# Altium project IMX6 DEV BOARD.PrjPcb (part 4 of 4)

## Sheet uart_console.SchDoc
size A4; SheetNumber: 16; SheetTotal: 21
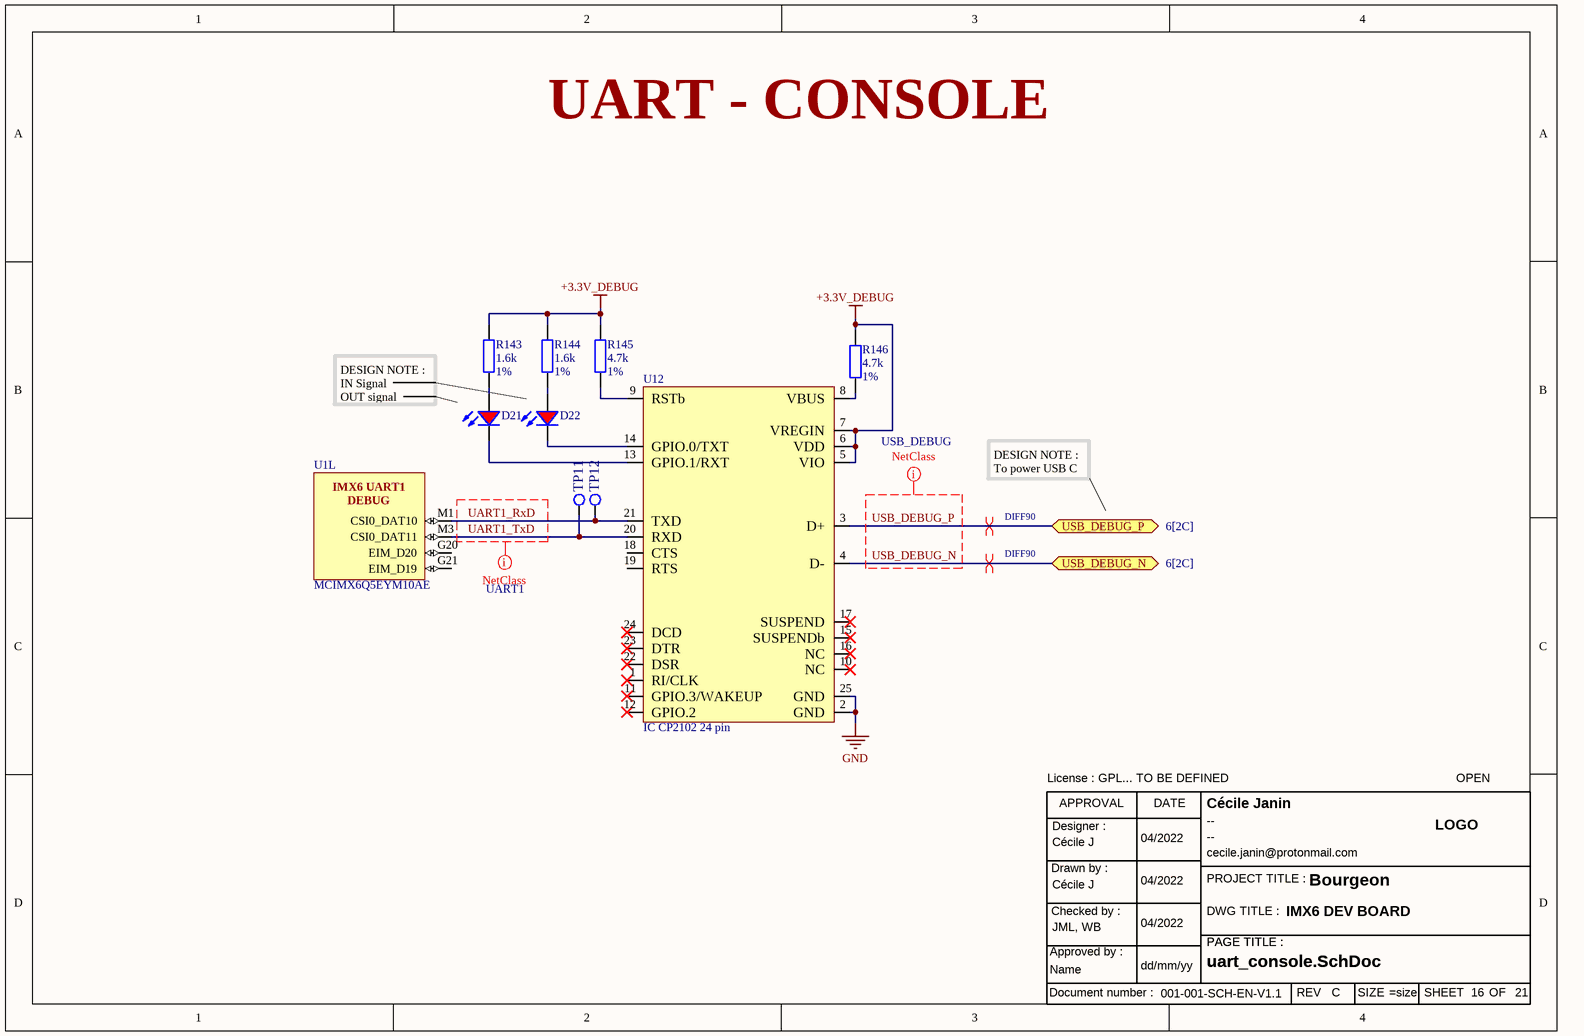
[diagram p18: uart_console.SchDoc]

### Parts
D21  Red, 2V, 120deg  [LED red 0603]  (value not drawn)
D22  Red, 2V, 120deg  [LED red 0603]  (value not drawn)
R143  1.6k  pourcentage: 1%  [Res 0402/1005]
R144  1.6k  pourcentage: 1%  [Res 0402/1005]
R145  4.7k  pourcentage: 1%  [Res 0402/1005]
R146  4.7k  pourcentage: 1%  [Res 0402/1005]
TB15  Title bloc ANSI modified  (value not drawn)
TP11  Test Point  [testpoint 1mm]  (value not drawn)
TP12  Test Point  [testpoint 1mm]  (value not drawn)
U1  MCIMX6Q5EYM10AE  [FRES-2197-01]  (part L of 21)
U12  IC CP2102 24 pin  [QFN24]

### Ports
USB_DEBUG_N (bidir, see 6[2C]), USB_DEBUG_P (bidir, see 6[2C])

### Nets
+3.3V_DEBUG: R143.2 R144.2 R145.2 R146.2 U12.5(VIO) U12.6(VDD) U12.7(VREGIN)
GND: U12.2(GND) U12.25(GND)
UART1_RxD: TP12.1(tp) U1.M1(CSI0_DAT10) U12.21(TXD)
UART1_TxD: TP11.1(tp) U1.M3(CSI0_DAT11) U12.20(RXD)
USB_DEBUG_N: U12.4(D-) ; port USB_DEBUG_N
USB_DEBUG_P: U12.3(D+) ; port USB_DEBUG_P
NetD21_1: D21.1(K) U12.13(GPIO.1/RXT)
NetD21_2: D21.2(A) R143.1
NetD22_1: D22.1(K) U12.14(GPIO.0/TXT)
NetD22_2: D22.2(A) R144.1
NetR145_1: R145.1 U12.9(RSTb)
NetR146_1: R146.1 U12.8(VBUS)

Not connected (* = marked no-connect by the designer): U1 G20(EIM_D20) G21(EIM_D19); U12 1(RI/CLK)* 10(NC)* 11(GPIO.3/WAKEUP)* 12(GPIO.2)* 15(SUSPENDb)* 16(NC)* 17(SUSPEND)* 18(CTS) 19(RTS) 22(DSR)* 23(DTR)* 24(DCD)*

### Layout directives
net class UART1: UART1_RxD, UART1_TxD
net class USB_DEBUG: USB_DEBUG_N, USB_DEBUG_P
differential pair; differential pair class DIFF90: USB_DEBUG_N, USB_DEBUG_P

### Notes on the sheet
- UART - CONSOLE
- DESIGN NOTE :
  IN Signal
  OUT signal
- DESIGN NOTE :
  To power USB C
- (in symbol IMX6Q5EYM10AE, part L) IMX6 UART1 / DEBUG
- (in symbol Title bloc ANSI) APPROVAL; DATE; Designer :; LOGO; Drawn by :; PROJECT TITLE :; Checked by :; DWG TITLE :; PAGE TITLE :; Approved by :; Document number :; REV; SIZE; SHEET; OF

### Library data of the parts
D21 D22 = LED Red 0603: WL-SMCC SMD Mono-color Chip LED Compact, size 0603, Red, 2V, 120deg 150060RS73220; Dominant Wavelength: 624nm; Luminous Intensity: 90mcd; Peak Wavelength: 632nm; Chip Technology: AlInGaP; ComponentLink1URL: http://www.we-online.de; ComponentLink2Description: Datasheet; ComponentLink2URL: https://katalog.we-online.com/led/datasheet/150060RS73220.pdf; Part Number: 150060RS73220; Published Date: July 2019; Publisher: Wurth Elektronik; Size: 0603; Viewing Angle: 120deg; Packaging: Tape and Reel; Emitting Color: Red; Mounting Technology: SMT; Forward Voltage: 2V; Operating Temperature: -40 to +85degC
R143 R144 = res 1.6k 1%: res 1.6k 1% 0402
R145 R146 = res 4.7k 1%: res 4.7k 1% 0402
TB15 = Title bloc ANSI
TP11 TP12 = Test Point: Test point 1mm diameter
U1 = IMX6Q5EYM10AE: 32-Bit i.MX 6 Quad Application Processor, 1 GHz, 256 KB RAM, Extended Consumer Grade, 624-Pin FCPBGA, RoHS, Tape and Reel; PartNumber: MCIMX6Q5EYM10ACR; Manufacturer: Freescale Semiconductor; CAN: FlexCAN; Number of Cores: 4 Spec; External Memory Supported: DDR3, DDR3L, FLASH, LPDDR2; Speed Grade: 1 GHz; Core Type: ARM Cortex A9; Cache (KB): 32; Ethernet: 1 Gbps + IEEE 1588; Internal RAM (KB): 256; ComponentLink1Description: Manufacturer URL; ComponentLink2Description: Datasheet; DatasheetVersion: Rev. 2.3; ComponentLink3URL: http://cache.freescale.com/files/32bit/doc/data_sheet/IMX6DQCEC.pdf?fpsp=1&WT_TYPE=Data%20Sheets&WT_VENDOR=FREESCALE&WT_FILE_FORMAT=pdf&WT_ASSET=Documentation; ComponentLink1URL: http://www.freescale.com/; Packing: Tape and Reel; Temperature Range: -20 to 105 degC; ComponentLink2URL: http://cache.freescale.com/files/32bit/doc/data_sheet/IMX6DQCEC.pdf?fpsp=1&WT_TYPE=Data%20Sheets&WT_VENDOR=FREESCALE&WT_FILE_FORMAT=pdf&WT_ASSET=Documentation; ComponentLink3Description: Package Specification; PackageVersion: Rev. A; RoHS: TRUE; Quad/Dual CPU: i.MX 6Quad; Mounting Technology: Surface Mount; PackageReference: FCPBGA-624; PackageDescription: 624-pin Ball Grid Array Package, Body 21 x 21mm, Pitch 0.8mm
U12 = IC CP2102 24 pin: UART to USB converter

## Sheet usb_host_otg.SchDoc
size A3; SheetNumber: 17; SheetTotal: 21
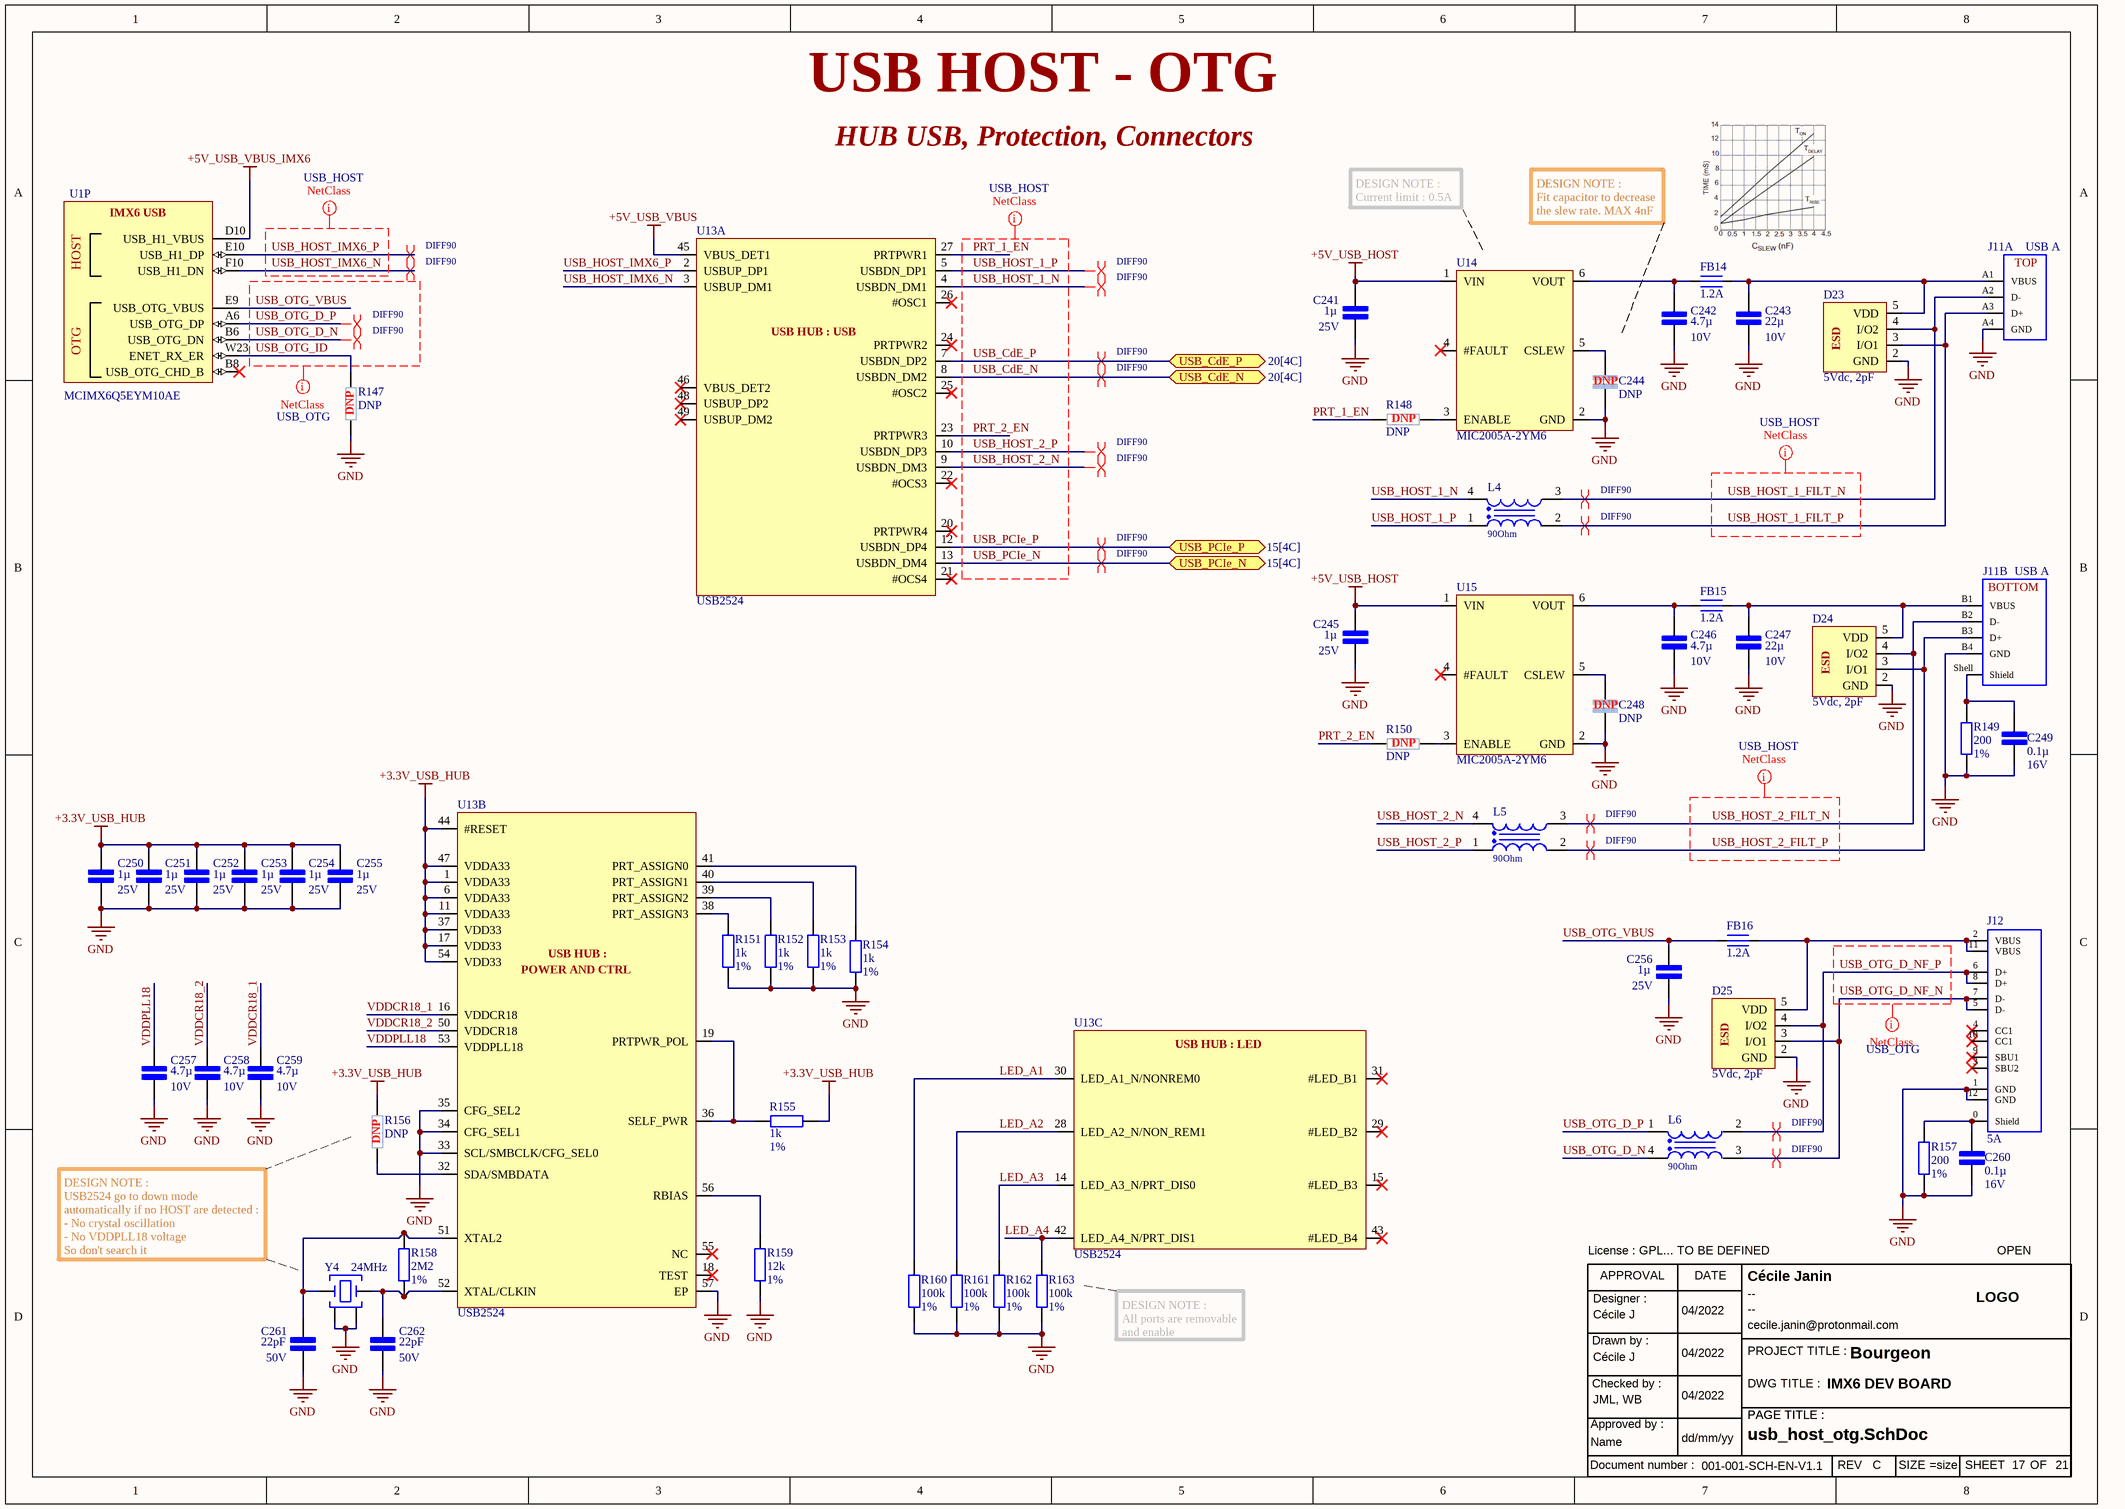
[diagram p19: usb_host_otg.SchDoc]

### Parts
C241  1µ  Tension du diélectrique: 25V  [Cap cer 0402/1005]
C242  4.7µ  Tension du diélectrique: 10V  [Cap cer 0402/1005]
C243  22µ  Tension du diélectrique: 10V  [Cap cer 0603/4608]
C244  DNP  [Cap cer 0402/1005]
C245  1µ  Tension du diélectrique: 25V  [Cap cer 0402/1005]
C246  4.7µ  Tension du diélectrique: 10V  [Cap cer 0402/1005]
C247  22µ  Tension du diélectrique: 10V  [Cap cer 0603/4608]
C248  DNP  [Cap cer 0402/1005]
C249  0.1µ  Tension du diélectrique: 16V  [Cap cer 0402/1005]
C250  1µ  Tension du diélectrique: 25V  [Cap cer 0402/1005]
C251  1µ  Tension du diélectrique: 25V  [Cap cer 0402/1005]
C252  1µ  Tension du diélectrique: 25V  [Cap cer 0402/1005]
C253  1µ  Tension du diélectrique: 25V  [Cap cer 0402/1005]
C254  1µ  Tension du diélectrique: 25V  [Cap cer 0402/1005]
C255  1µ  Tension du diélectrique: 25V  [Cap cer 0402/1005]
C256  1µ  Tension du diélectrique: 25V  [Cap cer 0402/1005]
C257  4.7µ  Tension du diélectrique: 10V  [Cap cer 0402/1005]
C258  4.7µ  Tension du diélectrique: 10V  [Cap cer 0402/1005]
C259  4.7µ  Tension du diélectrique: 10V  [Cap cer 0402/1005]
C260  0.1µ  Tension du diélectrique: 16V  [Cap cer 0402/1005]
C261  22pF  Tension du diélectrique: 50V  [Cap cer 0402/1005]
C262  22pF  Tension du diélectrique: 50V  [Cap cer 0402/1005]
D23  5Vdc, 2pF  [Sot-23-5]
D24  5Vdc, 2pF  [Sot-23-5]
D25  5Vdc, 2pF  [Sot-23-5]
FB14  1.2A  [inductor 0402/1005]
FB15  1.2A  [inductor 0402/1005]
FB16  1.2A  [inductor 0402/1005]
J11  USB A  [USBA_stacked_61400826021]  (parts A,B of 2)
J12  5A  [USB C 12 PIN 629722000214]
L4  90Ohm  [inductor coupled usb 0603]
L5  90Ohm  [inductor coupled usb 0603]
L6  90Ohm  [inductor coupled usb 0603]
R147  DNP  [Res 0402/1005]
R148  DNP  [Res 0402/1005]
R149  200  pourcentage: 1%  [Res 0402/1005]
R150  DNP  [Res 0402/1005]
R151  1k  pourcentage: 1%  [Res 0402/1005]
R152  1k  pourcentage: 1%  [Res 0402/1005]
R153  1k  pourcentage: 1%  [Res 0402/1005]
R154  1k  pourcentage: 1%  [Res 0402/1005]
R155  1k  pourcentage: 1%  [Res 0402/1005]
R156  DNP  [Res 0402/1005]
R157  200  pourcentage: 1%  [Res 0402/1005]
R158  2M2  pourcentage: 1%  [Res 0402/1005]
R159  12k  pourcentage: 1%  [Res 0402/1005]
R160  100k  pourcentage: 1%  [Res 0402/1005]
R161  100k  pourcentage: 1%  [Res 0402/1005]
R162  100k  pourcentage: 1%  [Res 0402/1005]
R163  100k  pourcentage: 1%  [Res 0402/1005]
TB16  Title bloc ANSI modified  (value not drawn)
U1  MCIMX6Q5EYM10AE  [FRES-2197-01]  (part P of 21)
U13  USB2524  [QFN56]  (parts A,B,C of 3)
U14  MIC2005A-2YM6  [SOt-23-6]
U15  MIC2005A-2YM6  [SOt-23-6]
Y4  24MHz  [IQXC-42]

### Ports
USB_CdE_N (bidir, see 20[4C]), USB_CdE_P (bidir, see 20[4C]), USB_PCIe_N (bidir, see 15[4C]), USB_PCIe_P (bidir, see 15[4C])

### Nets
+3.3V_USB_HUB: C250.1 C251.1 C252.1 C253.1 C254.1 C255.1 R155.2 R156.2 U13.1(VDDA33) U13.6(VDDA33) U13.11(VDDA33) U13.17(VDD33) U13.37(VDD33) U13.44(#RESET) U13.47(VDDA33) U13.54(VDD33)
+5V_USB_HOST: C241.1 C245.1 U14.1(VIN) U15.1(VIN)
+5V_USB_VBUS: U13.45(VBUS_DET1)
+5V_USB_VBUS_IMX6: U1.D10(USB_H1_VBUS)
GND: C241.2 C242.2 C243.2 C244.2 C245.2 C246.2 C247.2 C248.2 C249.2 C250.2 C251.2 C252.2 C253.2 C254.2 C255.2 C256.2 C257.2 C258.2 C259.2 C260.2 C261.2 C262.2 D23.2(GND) D24.2(GND) D25.2(GND) J11.A4(GND) J11.B4(GND) J12.1(GND) J12.12(GND) R147.1 R149.1 R151.1 R152.1 R153.1 R154.1 R157.1 R159.1 R160.1 R161.1 R162.1 R163.1 U13.33(SCL/SMBCLK/CFG_SEL0) U13.34(CFG_SEL1) U13.35(CFG_SEL2) U13.57(EP) U14.2(GND) U15.2(GND) Y4.2(GND) Y4.4(GND)
LED_A1: R160.2 U13.30(LED_A1_N/NONREM0)
LED_A2: R161.2 U13.28(LED_A2_N/NON_REM1)
LED_A3: R162.2 U13.14(LED_A3_N/PRT_DIS0)
LED_A4: R163.2 U13.42(LED_A4_N/PRT_DIS1)
PRT_1_EN: R148.1 U13.27(PRTPWR1)
PRT_2_EN: R150.1 U13.23(PRTPWR3)
USB_CdE_N: U13.8(USBDN_DM2) ; port USB_CdE_N
USB_CdE_P: U13.7(USBDN_DP2) ; port USB_CdE_P
USB_HOST_1_FILT_N: D23.4(I/O2) J11.A2(D-) L4.3
USB_HOST_1_FILT_P: D23.3(I/O1) J11.A3(D+) L4.2
USB_HOST_1_N: L4.4 U13.4(USBDN_DM1)
USB_HOST_1_P: L4.1 U13.5(USBDN_DP1)
USB_HOST_2_FILT_N: D24.4(I/O2) J11.B2(D-) L5.3
USB_HOST_2_FILT_P: D24.3(I/O1) J11.B3(D+) L5.2
USB_HOST_2_N: L5.4 U13.9(USBDN_DM3)
USB_HOST_2_P: L5.1 U13.10(USBDN_DP3)
USB_HOST_IMX6_N: U1.F10(USB_H1_DN) U13.3(USBUP_DM1)
USB_HOST_IMX6_P: U1.E10(USB_H1_DP) U13.2(USBUP_DP1)
USB_OTG_D_N: L6.4 U1.B6(USB_OTG_DN)
USB_OTG_D_NF_N: D25.3(I/O1) J12.5(D-) J12.7(D-) L6.3
USB_OTG_D_NF_P: D25.4(I/O2) J12.6(D+) J12.8(D+) L6.2
USB_OTG_D_P: L6.1 U1.A6(USB_OTG_DP)
USB_OTG_ID: R147.2 U1.W23(ENET_RX_ER)
USB_OTG_VBUS: C256.1 FB16.1 U1.E9(USB_OTG_VBUS)
USB_PCIe_N: U13.13(USBDN_DM4) ; port USB_PCIe_N
USB_PCIe_P: U13.12(USBDN_DP4) ; port USB_PCIe_P
VDDCR18_1: C259.1 U13.16(VDDCR18)
VDDCR18_2: C258.1 U13.50(VDDCR18)
VDDPLL18: C257.1 U13.53(VDDPLL18)
NetC242_1: C242.1 FB14.1 U14.6(VOUT)
NetC243_1: C243.1 D23.5(VDD) FB14.2 J11.A1(VBUS)
NetC244_1: C244.1 U14.5(CSLEW)
NetC246_1: C246.1 FB15.1 U15.6(VOUT)
NetC247_1: C247.1 D24.5(VDD) FB15.2 J11.B1(VBUS)
NetC248_1: C248.1 U15.5(CSLEW)
NetC249_1: C249.1 J11.Shell(Shield) R149.2
NetC260_1: C260.1 J12.0(Shield) R157.2
NetC261_1: C261.1 R158.2 U13.51(XTAL2) Y4.3(Crystal)
NetC262_1: C262.1 R158.1 U13.52(XTAL/CLKIN) Y4.1(Crystal)
NetD25_5: D25.5(VDD) FB16.2 J12.2(VBUS) J12.11(VBUS)
NetR148_2: R148.2 U14.3(ENABLE)
NetR150_2: R150.2 U15.3(ENABLE)
NetR151_2: R151.2 U13.38(PRT_ASSIGN3)
NetR152_2: R152.2 U13.39(PRT_ASSIGN2)
NetR153_2: R153.2 U13.40(PRT_ASSIGN1)
NetR154_2: R154.2 U13.41(PRT_ASSIGN0)
NetR155_1: R155.1 U13.19(PRTPWR_POL) U13.36(SELF_PWR)
NetR156_1: R156.1 U13.32(SDA/SMBDATA)
NetR159_2: R159.2 U13.56(RBIAS)

Not connected (* = marked no-connect by the designer): J12 3(SBU2)* 4(CC1)* 9(SBU1)* 10(CC1)*; U1 B8(USB_OTG_CHD_B)*; U13 15(#LED_B3)* 18(TEST)* 20(PRTPWR4)* 21(#OCS4)* 22(#OCS3)* 24(PRTPWR2)* 25(#OSC2)* 26(#OSC1)* 29(#LED_B2)* 31(#LED_B1)* 43(#LED_B4)* 46(VBUS_DET2)* 48(USBUP_DP2)* 49(USBUP_DM2)* 55(NC)*; U14 4(#FAULT)*; U15 4(#FAULT)*

### Layout directives
net class USB_OTG: USB_OTG_D_N, USB_OTG_D_NF_N, USB_OTG_D_NF_P, USB_OTG_D_P, USB_OTG_ID, USB_OTG_VBUS
net class USB_HOST: PRT_1_EN, PRT_2_EN, USB_CdE_N, USB_CdE_P, USB_HOST_1_FILT_N, USB_HOST_1_FILT_P, USB_HOST_1_N, USB_HOST_1_P, USB_HOST_2_FILT_N, USB_HOST_2_FILT_P, USB_HOST_2_N, USB_HOST_2_P, USB_HOST_IMX6_N, USB_HOST_IMX6_P, USB_PCIe_N, USB_PCIe_P
differential pair; differential pair class DIFF90: USB_CdE_N, USB_CdE_P, USB_HOST_1_FILT_N, USB_HOST_1_FILT_P, USB_HOST_1_N, USB_HOST_1_P, USB_HOST_2_FILT_N, USB_HOST_2_FILT_P, USB_HOST_2_N, USB_HOST_2_P, USB_HOST_IMX6_N, USB_HOST_IMX6_P, USB_OTG_D_N, USB_OTG_D_NF_N, USB_OTG_D_NF_P, USB_OTG_D_P, USB_PCIe_N, USB_PCIe_P

### Notes on the sheet
- USB HOST - OTG
- HUB USB, Protection, Connectors
- DESIGN NOTE :
  Current limit : 0.5A
- DESIGN NOTE :
  Fit capacitor to decrease the slew rate. MAX 4nF
- DESIGN NOTE :
  USB2524 go to down mode automatically if no HOST are detected :
  - No crystal oscillation
  - No VDDPLL18 voltage
  So don't search it
- DESIGN NOTE :
  All ports are removable and enable
- (in symbol IC USB2524, part A) USB HUB : USB
- (in symbol IC USB2524, part B) USB HUB :; POWER AND CTRL
- (in symbol IC USB2524, part C) USB HUB : LED
- (in symbol IMX6Q5EYM10AE, part P) IMX6 USB; HOST; OTG
- (in symbol Title bloc ANSI) APPROVAL; DATE; Designer :; LOGO; Drawn by :; PROJECT TITLE :; Checked by :; DWG TITLE :; PAGE TITLE :; Approved by :; Document number :; REV; SIZE; SHEET; OF
- (in symbol TVS USB 824011) ESD
- (in symbol USBA_stacked_61400826021, part A) TOP
- (in symbol USBA_stacked_61400826021, part B) BOTTOM

### Library data of the parts
C241 C245 C250-C256 = cap 1µ 25V: cap cer 1µ 25V 10% X5R 0402; Diélectrique: X5R
C242 C246 C257-C259 = cap 4.7µ 10V: cap cer 4.7µ 10V 10% X7R 0402; Diélectrique: X7R
C243 C247 = cap 22µ 10V: cap cer 22µ 10V 10% X5R 0603; Diélectrique: X5R
C244 C248 = cap DNP: cap cer DNP 0402
C249 C260 = cap 0.1µ 16V: cap solid electrolyte 0.1µ 6.3V 10%; Diélectrique: X7R
C261 C262 = cap 22pF 50V: cap cer 22pF 50V 5% NP0 0402; Diélectrique: NP0
D23-D25 = TVS USB 824011: WE-TVS TVS Diode – High Speed Series, SOT23-5L, 2+1 Channel, 5Vdc, 2pF; Manufacturer Part Number: 824011; Manufacturer: Wurth Elektronik; Reverse Peak Pulse Current: 13A; Channel ESD Clamping Voltage: 13V; Channel Operating Voltage: 5V; Channel Reverse Leakage Current: 1uA; ESD Air Discharge Capability: 24kV; ESD Contact Discharge Capability: 16kV; Polarity: Unidirectional; Reverse Breakdown Voltage: 6.1V; ComponentLink1Description: Manufacturer Link; ComponentLink1URL: http://www.we-online.de; ComponentLink2Description: Datasheet; ComponentLink2URL: https://www.we-online.com/catalog/datasheet/824011.pdf; Size: SOT23-5L; Mounting Technology: SMT; Packaging: Tape and Reel; Channel Input Capacitance: 2pF; Channel Number: 2+1; Height: 1.16mm; Length: 2.9mm; Operating Temperature max.: 125C; Operating Temperature min.: -55C; Width: 2.8mm
FB14-FB16 = Ferrite bead 0402: ferrite bead 1.2A 70mohm / 74269242111; ComponentLink1Description: New link; ComponentLink1URL: https://www.we-online.com/catalog/datasheet/74269242111.pdf
J11 = USBA_stacked_61400826021: 2x USB type A, stacked
J12 = USB C 12 pin 629722000214: 629722000214 wurth connector, up to 5A
L4-L6 = inductor coupled USB: WE-CNSW SMT Common Mode Line Filter, size 0603, 90Ohm, 0.55A, 50V; Manufacturer Part Number: 744230900; Manufacturer: Wurth Elektronik; DC Resistance max.: 0.145Ohm; Impedance Test Condition: 100MHz; Insulation Test Voltage: 125VAC; Winding Style: bifiliar; ComponentLink1Description: Manufacturer; ComponentLink1URL: http://www.we-online.de; ComponentLink2Description: Datasheet; ComponentLink2URL: https://www.we-online.com/catalog/datasheet/744230900.pdf; Operating Temperature: -40 to +125degC; Packaging: Tape and Reel; Published Date: April 2020; Rated Current: 0.55A; Size: 0603; Impedance: 90Ohm; Rated Voltage: 50V; Mounting Technology: SMT
R147 R148 R150 R156 = res DNP 0402: res DNP 0403; pourcentage: 1%
R149 R157 = res 200 1%: res 200 1% 0402
R151-R155 = res 1k 1%: res 1k 1% 0402
R158 = res 2M2 1%: res 2M2 1% 0402
R159 = res 12k 1%: res 12k 1% 0402
R160-R163 = res 100k 1%: res 100k 1% 0402
TB16 = Title bloc ANSI
U1 = IMX6Q5EYM10AE: as U1 on sheet uart_console; ComponentLink1Description: Manufacturer URL; ComponentLink2Description: Datasheet; DatasheetVersion: Rev. 2.3; ComponentLink3URL: http://cache.freescale.com/files/32bit/doc/data_sheet/IMX6DQCEC.pdf?fpsp=1&WT_TYPE=Data%20Sheets&WT_VENDOR=FREESCALE&WT_FILE_FORMAT=pdf&WT_ASSET=Documentation; ComponentLink1URL: http://www.freescale.com/; Packing: Tape and Reel; Temperature Range: -20 to 105 degC; ComponentLink2URL: http://cache.freescale.com/files/32bit/doc/data_sheet/IMX6DQCEC.pdf?fpsp=1&WT_TYPE=Data%20Sheets&WT_VENDOR=FREESCALE&WT_FILE_FORMAT=pdf&WT_ASSET=Documentation; ComponentLink3Description: Package Specification; PackageVersion: Rev. A; RoHS: TRUE; Quad/Dual CPU: i.MX 6Quad; Mounting Technology: Surface Mount; PackageReference: FCPBGA-624; PackageDescription: 624-pin Ball Grid Array Package, Body 21 x 21mm, Pitch 0.8mm
U13 = IC USB2524: USB hub 4 ports
U14 U15 = IC MIC2005A: Current limiter 0.5A; ComponentLink1Description: New link; ComponentLink1URL: https://ww1.microchip.com/downloads/aemDocuments/documents/APID/ProductDocuments/DataSheets/MIC20XX-Fixed-and-Adjustable-Current-Limiting-Power-Distribution-Switches-DS20006486B.pdf
Y4 = XTAL 24MHz: WE-XTAL 24MHz, +/-10ppm / 830108212309; Manufacturer: Wurth Elektronik; Load Capacitance: 10pF; ComponentLink2Description: Datasheet; ComponentLink2URL: https://www.we-online.com/catalog/datasheet/830108212309.pdf; Operating Temperature: -20 to +70degC; Packaging: Tape and Reel; Manufacturer Part Number: 830108212309; Published Date: July 2020; Frequency Stability: +/-10ppm; Frequency: 24MHz; Frequency Tolerance: +/-10ppm; Mounting Technology: SMT

## Sheet user_interface.SchDoc
size A4; SheetNumber: 18; SheetTotal: 21
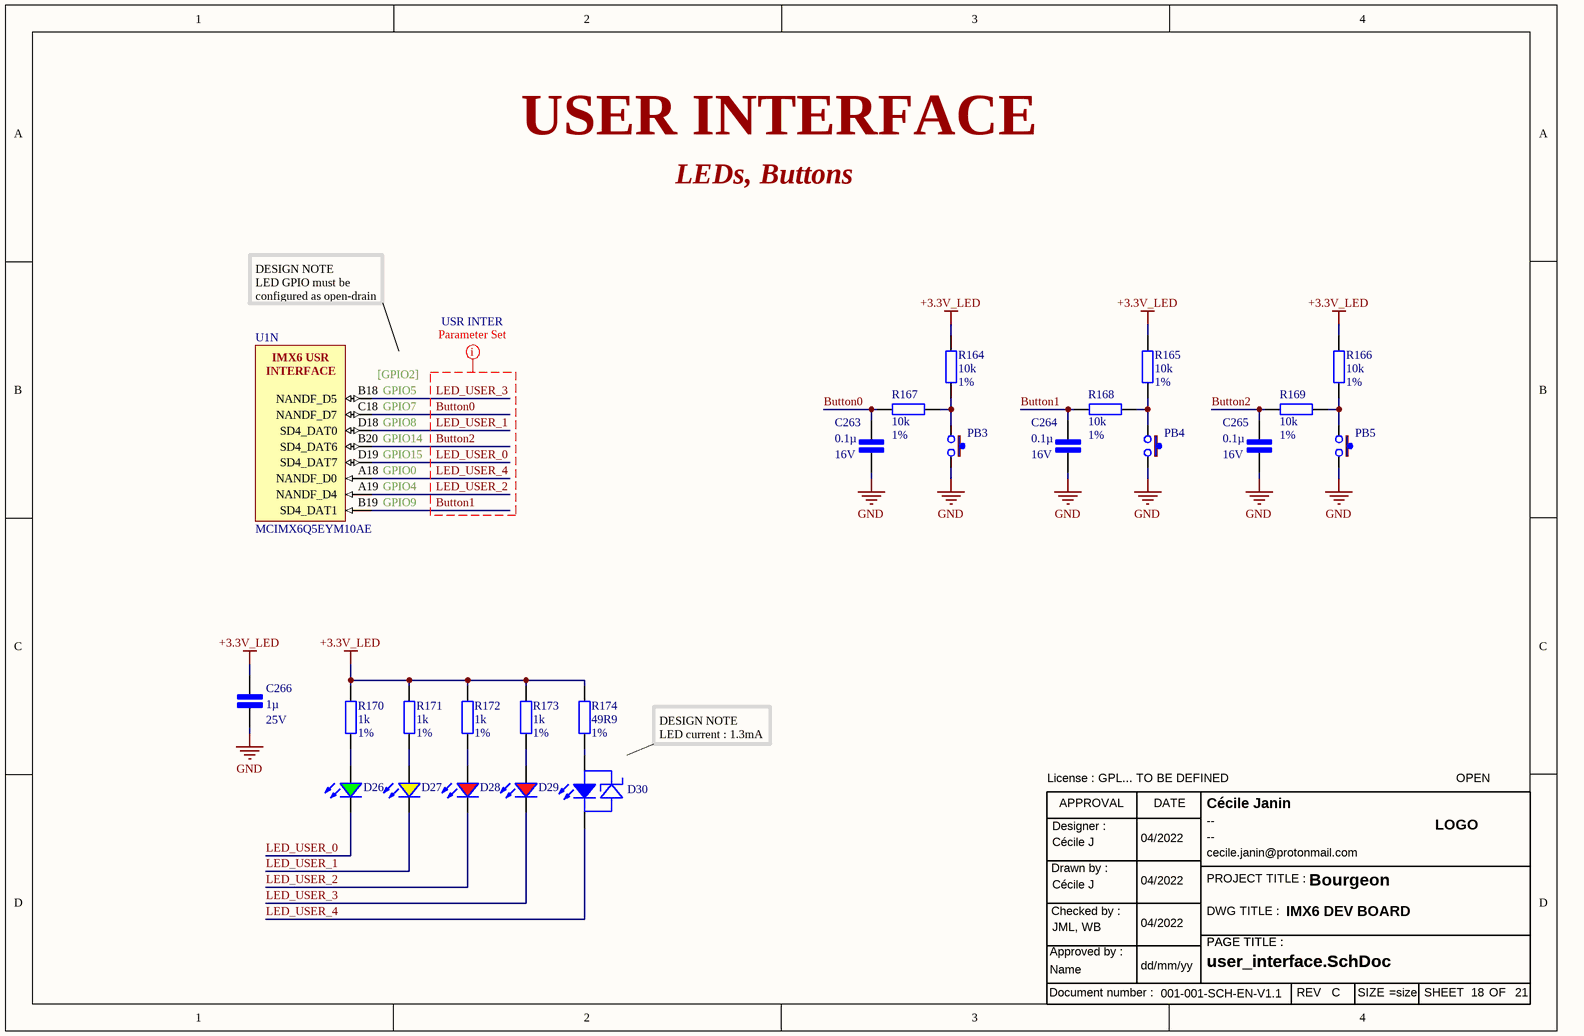
[diagram p20: user_interface.SchDoc]

### Parts
C263  0.1µ  Tension du diélectrique: 16V  [Cap cer 0402/1005]
C264  0.1µ  Tension du diélectrique: 16V  [Cap cer 0402/1005]
C265  0.1µ  Tension du diélectrique: 16V  [Cap cer 0402/1005]
C266  1µ  Tension du diélectrique: 25V  [Cap cer 0402/1005]
D26  Bright Green, 2V, 120deg  [LED green 0603]  (value not drawn)
D27  Yellow, 2V, 120deg  [LED yellow 0603]  (value not drawn)
D28  Red, 2V, 120deg  [LED red 0603]  (value not drawn)
D29  Red, 2V, 120deg  [LED red 0603]  (value not drawn)
D30  Blue, 3.2V, 120deg  [LED blue 0603]  (value not drawn)
PB3  pb_434121025816  [pb_434121025816]  (value not drawn)
PB4  pb_434121025816  [pb_434121025816]  (value not drawn)
PB5  pb_434121025816  [pb_434121025816]  (value not drawn)
R164  10k  pourcentage: 1%  [Res 0402/1005]
R165  10k  pourcentage: 1%  [Res 0402/1005]
R166  10k  pourcentage: 1%  [Res 0402/1005]
R167  10k  pourcentage: 1%  [Res 0402/1005]
R168  10k  pourcentage: 1%  [Res 0402/1005]
R169  10k  pourcentage: 1%  [Res 0402/1005]
R170  1k  pourcentage: 1%  [Res 0402/1005]
R171  1k  pourcentage: 1%  [Res 0402/1005]
R172  1k  pourcentage: 1%  [Res 0402/1005]
R173  1k  pourcentage: 1%  [Res 0402/1005]
R174  49R9  pourcentage: 1%  [Res 0402/1005]
TB17  Title bloc ANSI modified  (value not drawn)
U1  MCIMX6Q5EYM10AE  [FRES-2197-01]  (part N of 21)

### Nets
+3.3V_LED: C266.1 R164.2 R165.2 R166.2 R170.2 R171.2 R172.2 R173.2 R174.2
GND: C263.2 C264.2 C265.2 C266.2 PB3.2 PB4.2 PB5.2
Button0: C263.1 R167.2 U1.C18(NANDF_D7)
Button1: C264.1 R168.2 U1.B19(SD4_DAT1)
Button2: C265.1 R169.2 U1.B20(SD4_DAT6)
LED_USER_0: D26.1(K) U1.D19(SD4_DAT7)
LED_USER_1: D27.1(K) U1.D18(SD4_DAT0)
LED_USER_2: D28.1(K) U1.A19(NANDF_D4)
LED_USER_3: D29.1(K) U1.B18(NANDF_D5)
LED_USER_4: D30.1(K) U1.A18(NANDF_D0)
NetD26_2: D26.2(A) R170.1
NetD27_2: D27.2(A) R171.1
NetD28_2: D28.2(A) R172.1
NetD29_2: D29.2(A) R173.1
NetD30_2: D30.2(A) R174.1
NetPB3_1: PB3.1 R164.1 R167.1
NetPB4_1: PB4.1 R165.1 R168.1
NetPB5_1: PB5.1 R166.1 R169.1

### Layout directives
net class USR INTER: Button0, Button1, Button2, LED_USER_0, LED_USER_1, LED_USER_2, LED_USER_3, LED_USER_4

### Notes on the sheet
- USER INTERFACE
- LEDs, Buttons
- DESIGN NOTE
  LED GPIO must be configured as open-drain
- (near U1) [GPIO2]
- (near U1) GPIO5
- (near U1) GPIO7
- (near U1) GPIO8
- (near U1) GPIO14
- (near U1) GPIO15
- (near U1) GPIO0
- (near U1) GPIO4
- (near U1) GPIO9
- DESIGN NOTE
  LED current : 1.3mA
- (in symbol IMX6Q5EYM10AE, part N) IMX6 USR INTERFACE
- (in symbol Title bloc ANSI) APPROVAL; DATE; Designer :; LOGO; Drawn by :; PROJECT TITLE :; Checked by :; DWG TITLE :; PAGE TITLE :; Approved by :; Document number :; REV; SIZE; SHEET; OF

### Library data of the parts
C263-C265 = cap 0.1µ 16V: as C249 on sheet usb_host_otg
C266 = cap 1µ 25V: cap cer 1µ 25V 10% X5R 0402; Diélectrique: X5R
D26 = LED green 0603: WL-SMCC SMD Mono-color Chip LED Compact, size 0603, Bright Green, 2V, 120deg 150060VS73220; Dominant Wavelength: 573nm; Luminous Intensity: 60mcd; Peak Wavelength: 575nm; Chip Technology: AlInGaP; ComponentLink1URL: http://www.we-online.de; ComponentLink2Description: Datasheet; ComponentLink2URL: https://katalog.we-online.com/led/datasheet/150060VS73220.pdf; Part Number: 150060VS73220; Published Date: July 2019; Publisher: Wurth Elektronik; Size: 0603; Viewing Angle: 120deg; Packaging: Tape and Reel; Emitting Color: Bright Green; Mounting Technology: SMT; Forward Voltage: 2V; Operating Temperature: -40 to +85degC
D27 = LED Yellow 0603: WL-SMCC SMD Mono-color Chip LED Compact, size 0603, Yellow, 2V, 120deg 150060YS73220; Dominant Wavelength: 589nm; Luminous Intensity: 100mcd; Peak Wavelength: 591nm; Chip Technology: AlInGaP; ComponentLink1URL: http://www.we-online.de; ComponentLink2Description: Datasheet; ComponentLink2URL: https://katalog.we-online.com/led/datasheet/150060YS73220.pdf; Part Number: 150060YS73220; Published Date: July 2019; Publisher: Wurth Elektronik; Size: 0603; Viewing Angle: 120deg; Packaging: Tape and Reel; Emitting Color: Yellow; Mounting Technology: SMT; Forward Voltage: 2V; Operating Temperature: -40 to +85degC
D28 D29 = LED Red 0603: as D21 on sheet uart_console; ComponentLink1URL: http://www.we-online.de; ComponentLink2Description: Datasheet; ComponentLink2URL: https://katalog.we-online.com/led/datasheet/150060RS73220.pdf; Part Number: 150060RS73220; Published Date: July 2019; Publisher: Wurth Elektronik; Size: 0603; Viewing Angle: 120deg; Packaging: Tape and Reel; Emitting Color: Red; Mounting Technology: SMT; Forward Voltage: 2V; Operating Temperature: -40 to +85degC
D30 = LED blue 0603: WL-SMCC SMD Mono-color Chip LED Compact, size 0603, Blue, 3.2V, 120deg 150060BS73220; Dominant Wavelength: 470nm; Luminous Intensity: 170mcd; Peak Wavelength: 465nm; Chip Technology: InGaN; ComponentLink1URL: http://www.we-online.de; ComponentLink2Description: Datasheet; ComponentLink2URL: https://katalog.we-online.com/led/datasheet/150060BS73220.pdf; Part Number: 150060BS73220; Published Date: July 2019; Publisher: Wurth Elektronik; Size: 0603; Viewing Angle: 120deg; Packaging: Tape and Reel; Emitting Color: Blue; Mounting Technology: SMT; Forward Voltage: 3.2V; Operating Temperature: -40 to +85degC
R164-R169 = res 10k 1%: res 10k 1% 0402
R170-R173 = res 1k 1%: res 1k 1% 0402
R174 = res 49R9 1%: res 49R9 ohm 1% 0402
TB17 = Title bloc ANSI
U1 = IMX6Q5EYM10AE: as U1 on sheet uart_console; ComponentLink1Description: Manufacturer URL; ComponentLink2Description: Datasheet; DatasheetVersion: Rev. 2.3; ComponentLink3URL: http://cache.freescale.com/files/32bit/doc/data_sheet/IMX6DQCEC.pdf?fpsp=1&WT_TYPE=Data%20Sheets&WT_VENDOR=FREESCALE&WT_FILE_FORMAT=pdf&WT_ASSET=Documentation; ComponentLink1URL: http://www.freescale.com/; Packing: Tape and Reel; Temperature Range: -20 to 105 degC; ComponentLink2URL: http://cache.freescale.com/files/32bit/doc/data_sheet/IMX6DQCEC.pdf?fpsp=1&WT_TYPE=Data%20Sheets&WT_VENDOR=FREESCALE&WT_FILE_FORMAT=pdf&WT_ASSET=Documentation; ComponentLink3Description: Package Specification; PackageVersion: Rev. A; RoHS: TRUE; Quad/Dual CPU: i.MX 6Quad; Mounting Technology: Surface Mount; PackageReference: FCPBGA-624; PackageDescription: 624-pin Ball Grid Array Package, Body 21 x 21mm, Pitch 0.8mm

## Sheet extension_card.SchDoc
size A4; SheetNumber: 19; SheetTotal: 21
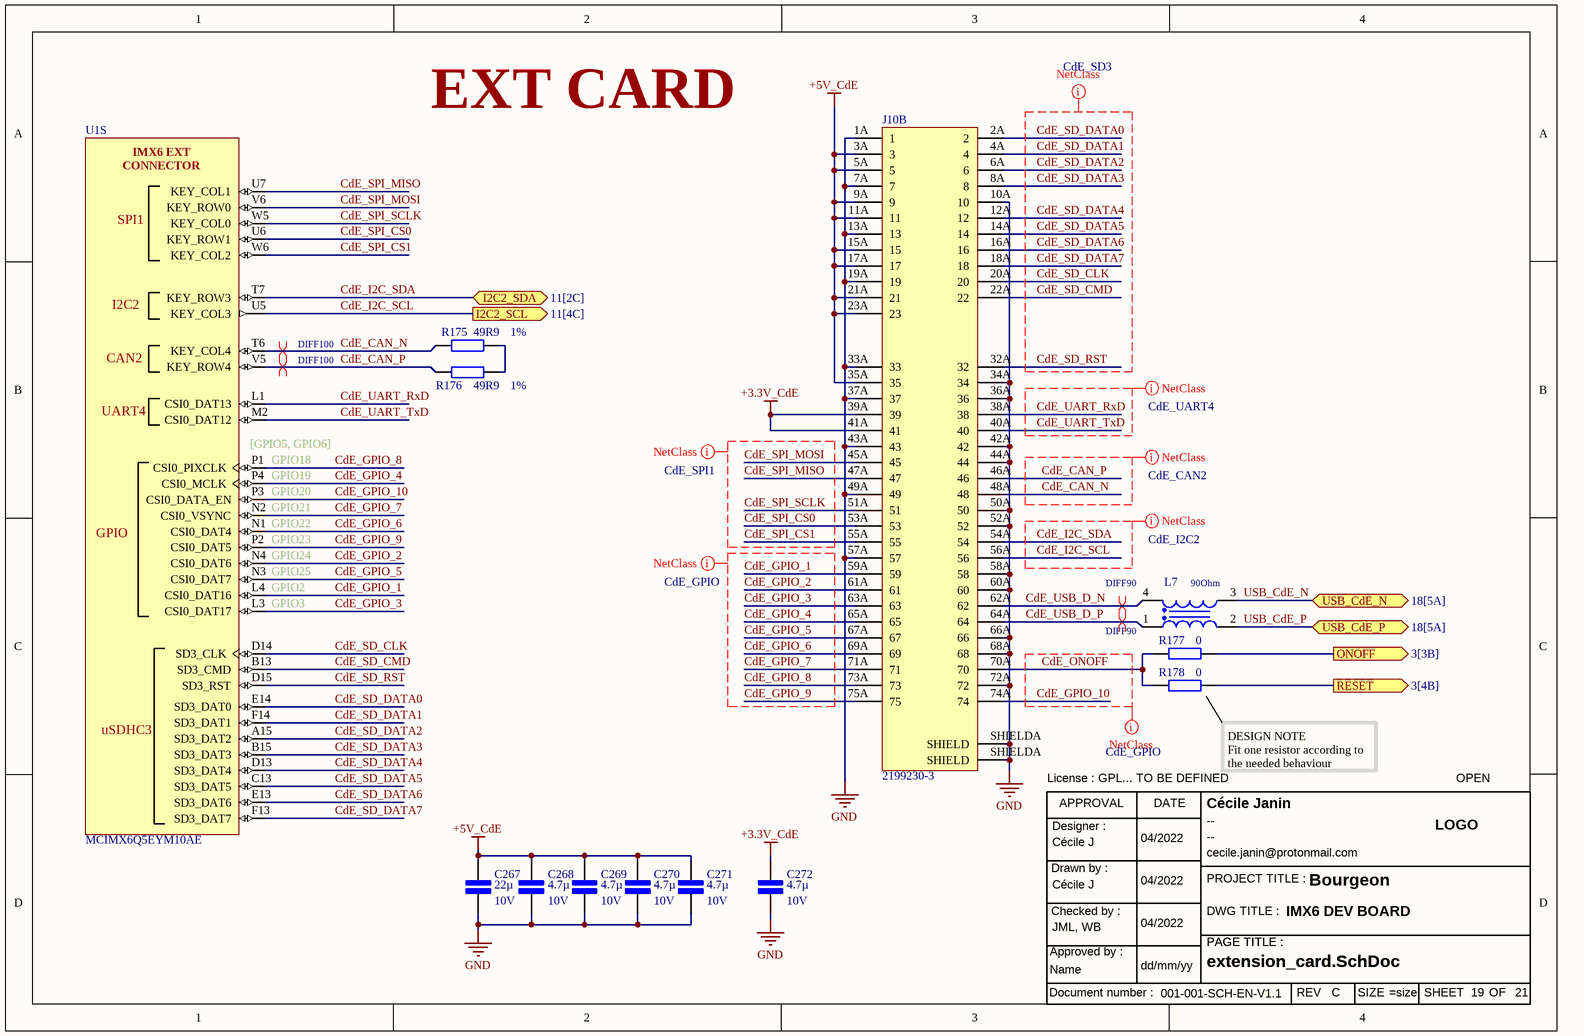
[diagram p21: extension_card.SchDoc]

### Parts
C267  22µ  Tension du diélectrique: 10V  [Cap cer 0603/4608]
C268  4.7µ  Tension du diélectrique: 10V  [Cap cer 0402/1005]
C269  4.7µ  Tension du diélectrique: 10V  [Cap cer 0402/1005]
C270  4.7µ  Tension du diélectrique: 10V  [Cap cer 0402/1005]
C271  4.7µ  Tension du diélectrique: 10V  [Cap cer 0402/1005]
C272  4.7µ  Tension du diélectrique: 10V  [Cap cer 0402/1005]
J10  2199230-3  [SATA_M2_ 2199230-3]  (part B of 2)
L7  90Ohm  [inductor coupled usb 0603]
R175  49R9  pourcentage: 1%  [Res 0402/1005]
R176  49R9  pourcentage: 1%  [Res 0402/1005]
R177  0  [Res 0603/1603]
R178  0  [Res 0603/1603]
TB18  Title bloc ANSI modified  (value not drawn)
U1  MCIMX6Q5EYM10AE  [FRES-2197-01]  (part S of 21)

### Ports
I2C2_SCL (out, see 11[4C]), I2C2_SDA (bidir, see 11[2C]), ONOFF (out, see 3[3B]), RESET (out, see 3[4B]), USB_CdE_N (bidir, see 18[5A]), USB_CdE_P (bidir, see 18[5A])

### Nets
+3.3V_CdE: C272.1 J10.39A(39) J10.41A(41)
+5V_CdE: C267.1 C268.1 C269.1 C270.1 C271.1 J10.3A(3) J10.5A(5) J10.9A(9) J10.11A(11) J10.15A(15) J10.17A(17) J10.21A(21) J10.23A(23) J10.35A(35)
GND: C267.2 C268.2 C269.2 C270.2 C271.2 C272.2 J10.1A(1) J10.7A(7) J10.10A(10) J10.13A(13) J10.19A(19) J10.33A(33) J10.34A(34) J10.36A(36) J10.37A(37) J10.42A(42) J10.43A(43) J10.44A(44) J10.49A(49) J10.50A(50) J10.52A(52) J10.57A(57) J10.58A(58) J10.60A(60) J10.66A(66) J10.68A(68) J10.72A(72) J10.SHIELDA(SHIELD)
CdE_CAN_N: J10.48A(48) R175.2 U1.T6(KEY_COL4)
CdE_CAN_P: J10.46A(46) R176.2 U1.V5(KEY_ROW4)
CdE_GPIO_1: J10.59A(59) U1.L4(CSI0_DAT16)
CdE_GPIO_2: J10.61A(61) U1.N4(CSI0_DAT6)
CdE_GPIO_3: J10.63A(63) U1.L3(CSI0_DAT17)
CdE_GPIO_4: J10.65A(65) U1.P4(CSI0_MCLK)
CdE_GPIO_5: J10.67A(67) U1.N3(CSI0_DAT7)
CdE_GPIO_6: J10.69A(69) U1.N1(CSI0_DAT4)
CdE_GPIO_7: J10.71A(71) U1.N2(CSI0_VSYNC)
CdE_GPIO_8: J10.73A(73) U1.P1(CSI0_PIXCLK)
CdE_GPIO_9: J10.75A(75) U1.P2(CSI0_DAT5)
CdE_GPIO_10: J10.74A(74) U1.P3(CSI0_DATA_EN)
CdE_I2C_SCL: J10.56A(56) U1.U5(KEY_COL3) ; port I2C2_SCL
CdE_I2C_SDA: J10.54A(54) U1.T7(KEY_ROW3) ; port I2C2_SDA
CdE_ONOFF: J10.70A(70) R177.1 R178.1
CdE_SD_CLK: J10.20A(20) U1.D14(SD3_CLK)
CdE_SD_CMD: J10.22A(22) U1.B13(SD3_CMD)
CdE_SD_DATA0: J10.2A(2) U1.E14(SD3_DAT0)
CdE_SD_DATA1: J10.4A(4) U1.F14(SD3_DAT1)
CdE_SD_DATA2: J10.6A(6) U1.A15(SD3_DAT2)
CdE_SD_DATA3: J10.8A(8) U1.B15(SD3_DAT3)
CdE_SD_DATA4: J10.12A(12) U1.D13(SD3_DAT4)
CdE_SD_DATA5: J10.14A(14) U1.C13(SD3_DAT5)
CdE_SD_DATA6: J10.16A(16) U1.E13(SD3_DAT6)
CdE_SD_DATA7: J10.18A(18) U1.F13(SD3_DAT7)
CdE_SD_RST: J10.32A(32) U1.D15(SD3_RST)
CdE_SPI_CS0: J10.53A(53) U1.U6(KEY_ROW1)
CdE_SPI_CS1: J10.55A(55) U1.W6(KEY_COL2)
CdE_SPI_MISO: J10.47A(47) U1.U7(KEY_COL1)
CdE_SPI_MOSI: J10.45A(45) U1.V6(KEY_ROW0)
CdE_SPI_SCLK: J10.51A(51) U1.W5(KEY_COL0)
CdE_UART_RxD: J10.38A(38) U1.L1(CSI0_DAT13)
CdE_UART_TxD: J10.40A(40) U1.M2(CSI0_DAT12)
CdE_USB_D_N: J10.62A(62) L7.4
CdE_USB_D_P: J10.64A(64) L7.1
ONOFF: R177.2 ; port ONOFF
USB_CdE_N: L7.3 ; port USB_CdE_N
USB_CdE_P: L7.2 ; port USB_CdE_P
NetC11_1: R178.2 ; port RESET
NetR175_1: R175.1 R176.1

### Layout directives
net class CdE_SPI1: CdE_SPI_CS0, CdE_SPI_CS1, CdE_SPI_MISO, CdE_SPI_MOSI, CdE_SPI_SCLK
net class CdE_SD3: CdE_SD_CLK, CdE_SD_CMD, CdE_SD_DATA0, CdE_SD_DATA1, CdE_SD_DATA2, CdE_SD_DATA3, CdE_SD_DATA4, CdE_SD_DATA5, CdE_SD_DATA6, CdE_SD_DATA7, CdE_SD_RST
differential pair; differential pair class DIFF90: CdE_USB_D_N, CdE_USB_D_P
net class CdE_GPIO: CdE_GPIO_1, CdE_GPIO_2, CdE_GPIO_3, CdE_GPIO_4, CdE_GPIO_5, CdE_GPIO_6, CdE_GPIO_7, CdE_GPIO_8, CdE_GPIO_9, CdE_GPIO_10, CdE_ONOFF
net class CdE_UART4: CdE_UART_RxD, CdE_UART_TxD
net class CdE_CAN2: CdE_CAN_N, CdE_CAN_P
net class CdE_I2C2: CdE_I2C_SCL, CdE_I2C_SDA
differential pair; differential pair class DIFF100: CdE_CAN_N, CdE_CAN_P

### Notes on the sheet
- EXT CARD
- (near U1) [GPIO5, GPIO6]
- (near U1) GPIO18
- (near U1) GPIO19
- (near U1) GPIO20
- (near U1) GPIO21
- (near U1) GPIO22
- (near U1) GPIO23
- (near U1) GPIO24
- (near U1) GPIO25
- (near U1) GPIO2
- (near U1) GPIO3
- DESIGN NOTE
  Fit one resistor according to the needed behaviour
- (in symbol IMX6Q5EYM10AE, part S) IMX6 EXT CONNECTOR; SPI1; I2C2; CAN2; UART4; GPIO; uSDHC3
- (in symbol Title bloc ANSI) APPROVAL; DATE; Designer :; LOGO; Drawn by :; PROJECT TITLE :; Checked by :; DWG TITLE :; PAGE TITLE :; Approved by :; Document number :; REV; SIZE; SHEET; OF

### Library data of the parts
C267 = cap 22µ 10V: cap cer 22µ 10V 10% X5R 0603; Diélectrique: X5R
C268-C272 = cap 4.7µ 10V: cap cer 4.7µ 10V 10% X7R 0402; Diélectrique: X7R
J10 = SATA_M.2_2199230-3 / multi interface: Combined component with SATA M.2 and external card connector (M.2 format too) / ref : / 2199230-4 / 2199230-3
L7 = inductor coupled USB: as L4-L6 on sheet usb_host_otg; ComponentLink1Description: Manufacturer; ComponentLink1URL: http://www.we-online.de; ComponentLink2Description: Datasheet; ComponentLink2URL: https://www.we-online.com/catalog/datasheet/744230900.pdf; Operating Temperature: -40 to +125degC; Packaging: Tape and Reel; Published Date: April 2020; Rated Current: 0.55A; Size: 0603; Impedance: 90Ohm; Rated Voltage: 50V; Mounting Technology: SMT
R175 R176 = res 49R9 1%: res 49R9 ohm 1% 0402
R177 R178 = res 0Ohm: res 0603; pourcentage: --
TB18 = Title bloc ANSI
U1 = IMX6Q5EYM10AE: as U1 on sheet uart_console; ComponentLink1Description: Manufacturer URL; ComponentLink2Description: Datasheet; DatasheetVersion: Rev. 2.3; ComponentLink3URL: http://cache.freescale.com/files/32bit/doc/data_sheet/IMX6DQCEC.pdf?fpsp=1&WT_TYPE=Data%20Sheets&WT_VENDOR=FREESCALE&WT_FILE_FORMAT=pdf&WT_ASSET=Documentation; ComponentLink1URL: http://www.freescale.com/; Packing: Tape and Reel; Temperature Range: -20 to 105 degC; ComponentLink2URL: http://cache.freescale.com/files/32bit/doc/data_sheet/IMX6DQCEC.pdf?fpsp=1&WT_TYPE=Data%20Sheets&WT_VENDOR=FREESCALE&WT_FILE_FORMAT=pdf&WT_ASSET=Documentation; ComponentLink3Description: Package Specification; PackageVersion: Rev. A; RoHS: TRUE; Quad/Dual CPU: i.MX 6Quad; Mounting Technology: Surface Mount; PackageReference: FCPBGA-624; PackageDescription: 624-pin Ball Grid Array Package, Body 21 x 21mm, Pitch 0.8mm

## Sheet mechanical_marking.SchDoc
size A4; SheetNumber: 20; SheetTotal: 21
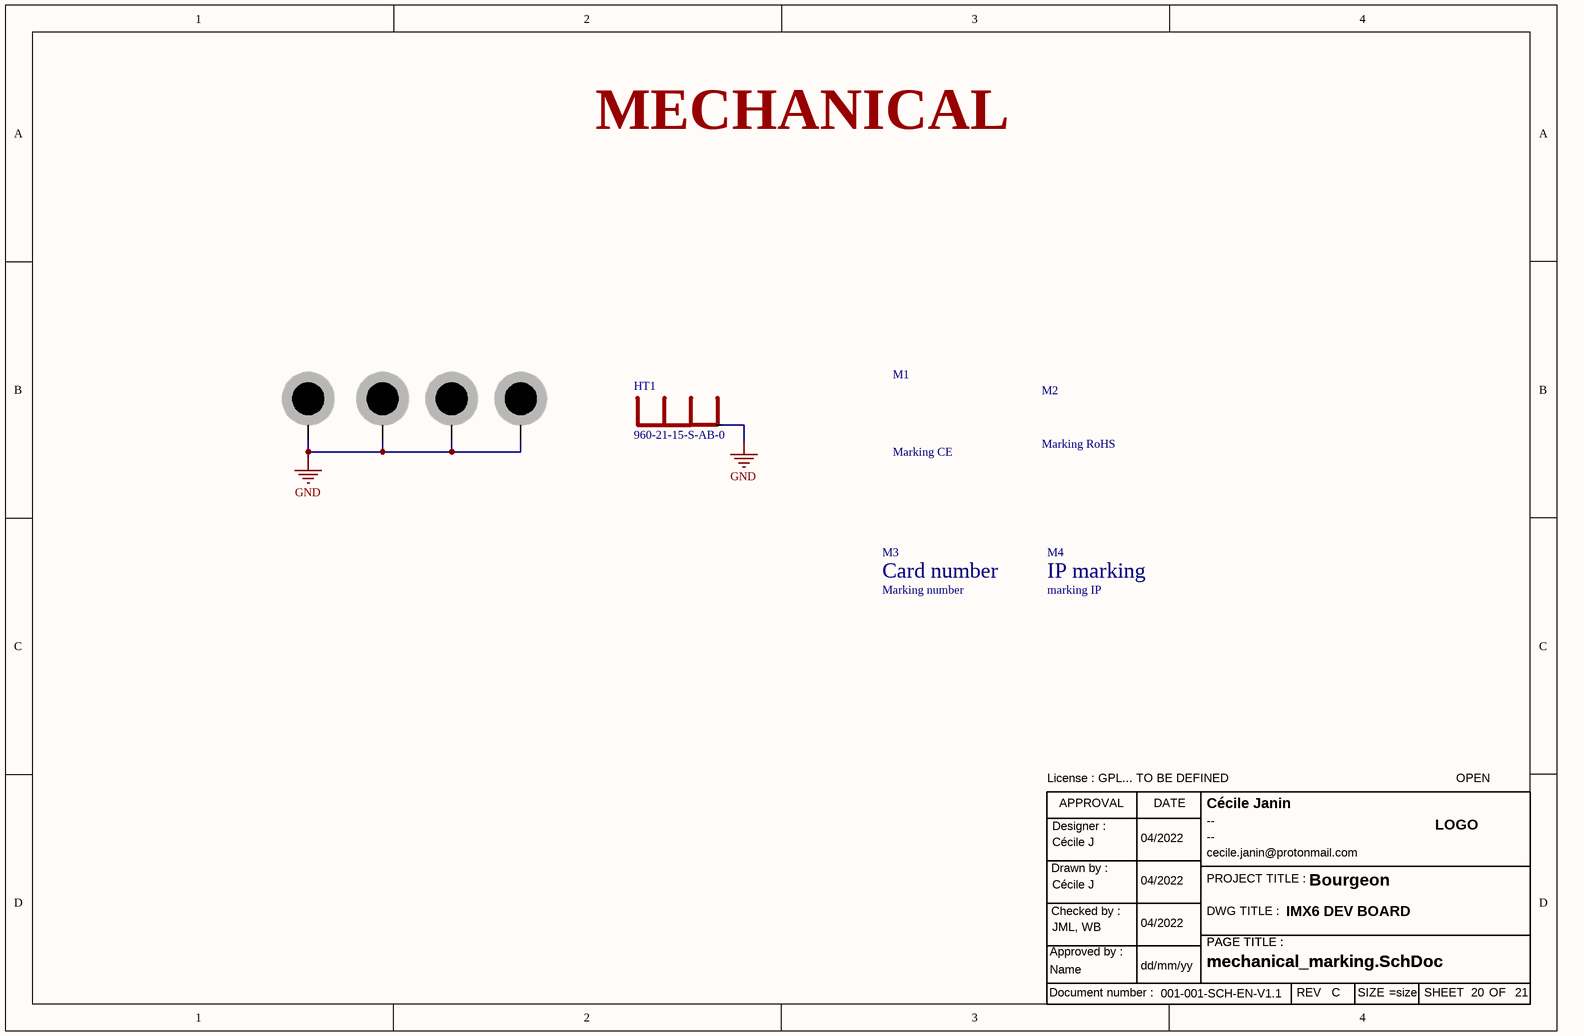
[diagram p22: mechanical_marking.SchDoc]

### Parts
HT1  960-21-15-S-AB-0  [Heatsink BGA 21x21mm]
M1  Marking CE  [MARKING CE]
M2  Marking RoHS  [MARKING ROHS]
M3  Marking number  [MARKING number]
M4  marking IP  [MARKING IP]
MT1  Mounting hole  [mountinghole]  (value not drawn)
MT2  Mounting hole  [mountinghole]  (value not drawn)
MT3  Mounting hole  [mountinghole]  (value not drawn)
MT4  Mounting hole  [mountinghole]  (value not drawn)
TB19  Title bloc ANSI modified  (value not drawn)

### Nets
GND: HT1.1 MT1.0 MT2.0 MT3.0 MT4.0

### Notes on the sheet
- MECHANICAL
- (in symbol marking IP) IP marking
- (in symbol Title bloc ANSI) APPROVAL; DATE; Designer :; LOGO; Drawn by :; PROJECT TITLE :; Checked by :; DWG TITLE :; PAGE TITLE :; Approved by :; Document number :; REV; SIZE; SHEET; OF

### Library data of the parts
HT1 = Heatsink BGA 21x21mm: / Heatsink : 960-21-15-S-AB-0 / 6°/W @ 200LFM
M1 = Marking CE: CE marking
M2 = Marking RoHS: RoHS marking
M3 = Marking number: Card number
M4 = marking IP: for IP marking
MT1-MT4 = Mounting hole: mounting hole / H : 3.2mm / D : 5.2mm
TB19 = Title bloc ANSI

## Sheet imx6_unused_pin.SchDoc
size A4; SheetNumber: 21; SheetTotal: 21
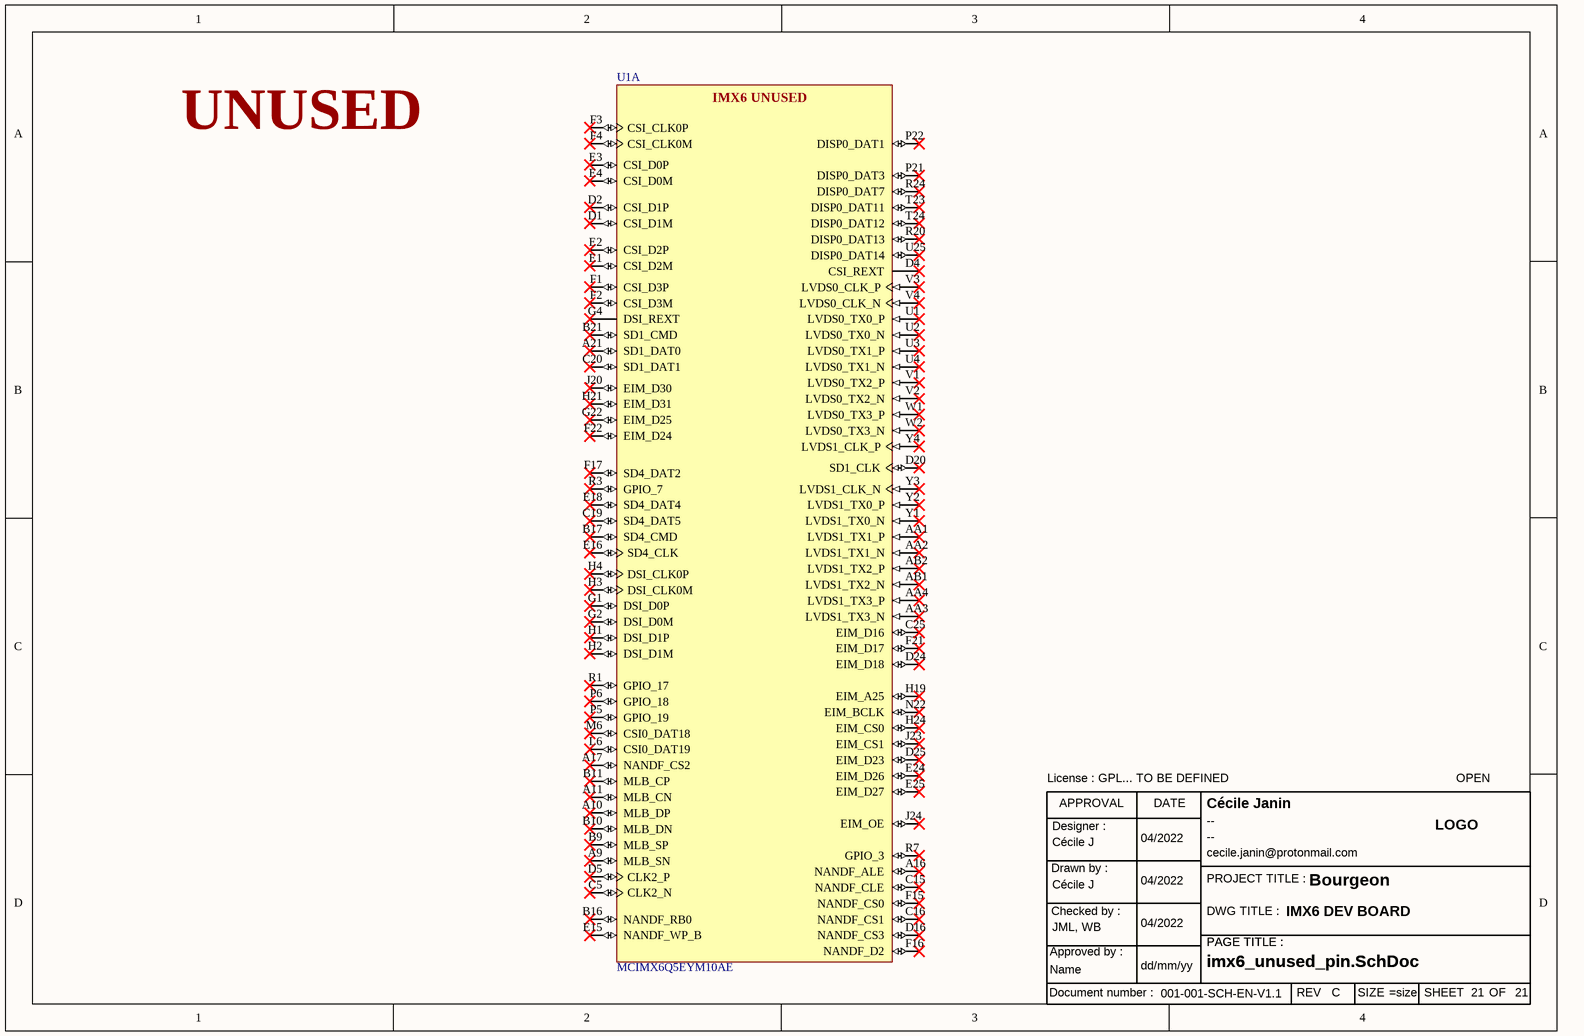
[diagram p23: imx6_unused_pin.SchDoc]

### Parts
TB22  Title bloc ANSI modified  (value not drawn)
U1  MCIMX6Q5EYM10AE  [FRES-2197-01]  (part A of 21)

### Nets

Not connected (* = marked no-connect by the designer): U1 A9(MLB_SN)* A10(MLB_DP)* A11(MLB_CN)* A16(NANDF_ALE)* A17(NANDF_CS2)* A21(SD1_DAT0)* AA1(LVDS1_TX1_P)* AA2(LVDS1_TX1_N)* AA3(LVDS1_TX3_N)* AA4(LVDS1_TX3_P)* AB1(LVDS1_TX2_N)* AB2(LVDS1_TX2_P)* B9(MLB_SP)* B10(MLB_DN)* B11(MLB_CP)* B16(NANDF_RB0)* B17(SD4_CMD)* B21(SD1_CMD)* C5(CLK2_N)* C15(NANDF_CLE)* C16(NANDF_CS1)* C19(SD4_DAT5)* C20(SD1_DAT1)* C25(EIM_D16)* D1(CSI_D1M)* D2(CSI_D1P)* D4(CSI_REXT)* D5(CLK2_P)* D16(NANDF_CS3)* D20(SD1_CLK)* D24(EIM_D18)* D25(EIM_D23)* E1(CSI_D2M)* E2(CSI_D2P)* E3(CSI_D0P)* E4(CSI_D0M)* E15(NANDF_WP_B)* E16(SD4_CLK)* E18(SD4_DAT4)* E24(EIM_D26)* E25(EIM_D27)* F1(CSI_D3P)* F2(CSI_D3M)* F3(CSI_CLK0P)* F4(CSI_CLK0M)* F15(NANDF_CS0)* F16(NANDF_D2)* F17(SD4_DAT2)* F21(EIM_D17)* F22(EIM_D24)* G1(DSI_D0P)* G2(DSI_D0M)* G4(DSI_REXT)* G22(EIM_D25)* H1(DSI_D1P)* H2(DSI_D1M)* H3(DSI_CLK0M)* H4(DSI_CLK0P)* H19(EIM_A25)* H21(EIM_D31)* H24(EIM_CS0)* J20(EIM_D30)* J23(EIM_CS1)* J24(EIM_OE)* L6(CSI0_DAT19)* M6(CSI0_DAT18)* N22(EIM_BCLK)* P5(GPIO_19)* P6(GPIO_18)* P21(DISP0_DAT3)* P22(DISP0_DAT1)* R1(GPIO_17)* R3(GPIO_7)* R7(GPIO_3)* R20(DISP0_DAT13)* R24(DISP0_DAT7)* T23(DISP0_DAT11)* T24(DISP0_DAT12)* U1(LVDS0_TX0_P)* U2(LVDS0_TX0_N)* U3(LVDS0_TX1_P)* U4(LVDS0_TX1_N)* U25(DISP0_DAT14)* V1(LVDS0_TX2_P)* V2(LVDS0_TX2_N)* V3(LVDS0_CLK_P)* V4(LVDS0_CLK_N)* W1(LVDS0_TX3_P)* W2(LVDS0_TX3_N)* Y1(LVDS1_TX0_N)* Y2(LVDS1_TX0_P)* Y3(LVDS1_CLK_N)* Y4(LVDS1_CLK_P)*

### Notes on the sheet
- UNUSED
- (in symbol IMX6Q5EYM10AE, part A) IMX6 UNUSED
- (in symbol Title bloc ANSI) APPROVAL; DATE; Designer :; LOGO; Drawn by :; PROJECT TITLE :; Checked by :; DWG TITLE :; PAGE TITLE :; Approved by :; Document number :; REV; SIZE; SHEET; OF

### Library data of the parts
TB22 = Title bloc ANSI
U1 = IMX6Q5EYM10AE: as U1 on sheet uart_console; ComponentLink1Description: Manufacturer URL; ComponentLink2Description: Datasheet; DatasheetVersion: Rev. 2.3; ComponentLink3URL: http://cache.freescale.com/files/32bit/doc/data_sheet/IMX6DQCEC.pdf?fpsp=1&WT_TYPE=Data%20Sheets&WT_VENDOR=FREESCALE&WT_FILE_FORMAT=pdf&WT_ASSET=Documentation; ComponentLink1URL: http://www.freescale.com/; Packing: Tape and Reel; Temperature Range: -20 to 105 degC; ComponentLink2URL: http://cache.freescale.com/files/32bit/doc/data_sheet/IMX6DQCEC.pdf?fpsp=1&WT_TYPE=Data%20Sheets&WT_VENDOR=FREESCALE&WT_FILE_FORMAT=pdf&WT_ASSET=Documentation; ComponentLink3Description: Package Specification; PackageVersion: Rev. A; RoHS: TRUE; Quad/Dual CPU: i.MX 6Quad; Mounting Technology: Surface Mount; PackageReference: FCPBGA-624; PackageDescription: 624-pin Ball Grid Array Package, Body 21 x 21mm, Pitch 0.8mm

## Nets that join several sheets
+0.75_DRAM_VTT: power_regulator_pmic (R207.2 TP22.1 U2.19), dram (40 pins)
+0.75V_VREF_DRAM: power_regulator_pmic (C313.1 FB27.2 TP23.1), dram (18 pins)
+1.1V_PHY: power_regulator_pmic (R199.2 TP15.1), ethernet (6 pins)
+1.5V_DRAM: power_regulator_pmic (FB25.2 TP19.1), imx6_power (26 pins), dram (120 pins)
+1.5V_PCIe: power_regulator_pmic (FB26.2 TP20.1), mini_pcie (6 pins)
+1.8V_AUDIO: power_regulator_pmic (R217.2 TP25.1), audio_codec (C216.2 U11.20)
+1.375_VDD_ARM: power_regulator_pmic (R197.2 TP14.1 U2.6), imx6_power (31 pins)
+1.375_VDD_SOC_IN: power_regulator_pmic (R200.2 TP16.1 U2.13), imx6_power (21 pins)
+2.5V_TRANS: power_regulator_pmic (R203.2 TP18.1), imx6_power (C98.1 C99.1 U1.G18 U1.R19), ethernet (14 pins)
+2.8V_VDD_HIGH: power_regulator_pmic (R206.2 TP21.1), imx6_power (5 pins)
+3.0V_VSNVS: imx6_ctrl_i2c1 (R1.2 R2.2 R4.2), imx6_boot (R179.2 R180.2 R181.2 R182.2), power_regulator_pmic (C314.1 TP24.1 U2.43), imx6_power (C100.1 D1.K U1.G11)
+3.3V: imx6_ctrl_i2c1 (R3.2 R15.2 R16.2), imx6_boot (16 pins), power_regulator_pmic (18 pins), sd_flash_eeprom (R105.2), hdmi (7 pins)
+3.3V_AUDIO: power_regulator_pmic (FB20.2), audio_codec (C217.2 C218.2 U11.3 U11.12)
+3.3V_CARD: power_regulator_aux (10 pins), jtag (5 pins), mini_pcie (R138.1 R139.1 R140.1)
+3.3V_CdE: power_regulator_aux (FB3.2), extension_card (C272.1 J10.39A J10.41A)
+3.3V_DEBUG: power_regulator_pmic (FB17.2), uart_console (7 pins)
+3.3V_flash_EEPROM: power_regulator_pmic (FB19.2), sd_flash_eeprom (8 pins)
+3.3V_GPIO: power_regulator_pmic (FB23.2), gpio (F2.2)
+3.3V_IMX6_IO: power_regulator_pmic (FB24.2), imx6_power (21 pins)
+3.3V_LED: power_regulator_pmic (FB22.2), user_interface (9 pins)
+3.3V_M2_SATA: power_regulator_aux (FB4.2), sata_m2 (11 pins)
+3.3V_PCIe: power_regulator_aux (FB2.2), mini_pcie (10 pins)
+3.3V_SD: power_regulator_pmic (FB18.2), sd_flash_eeprom (5 pins)
+3.3V_USB_HUB: power_regulator_pmic (FB21.2), usb_host_otg (16 pins)
+4.4V: imx6_ctrl_i2c1 (C3.1 U2.50), power_regulator_pmic (25 pins)
+5V: power_regulator_pmic (D31.A), power_regulator_aux (15 pins)
+5V_CdE: power_regulator_aux (FB7.2), extension_card (14 pins)
+5V_GPIO: power_regulator_aux (FB8.2), gpio (F3.2)
+5V_HDMI: power_regulator_aux (FB6.2), hdmi (C208.1 F4.1)
+5V_USB_HOST: power_regulator_aux (FB5.2), usb_host_otg (C241.1 C245.1 U14.1 U15.1)
+5V_USB_VBUS: power_regulator_aux (FB9.2), usb_host_otg (U13.45)
+5V_USB_VBUS_IMX6: power_regulator_aux (FB10.2), usb_host_otg (U1.D10)
GND: imx6_ctrl_i2c1 (19 pins), imx6_boot (36 pins), power_regulator_pmic (47 pins), power_regulator_aux (21 pins), imx6_power (202 pins), dram (165 pins), ethernet (28 pins), sd_flash_eeprom (16 pins), gpio (12 pins), hdmi (19 pins), jtag (J6.4 R126.1), audio_codec (14 pins), mini_pcie (29 pins), sata_m2 (21 pins), uart_console (U12.2 U12.25), usb_host_otg (49 pins), user_interface (7 pins), extension_card (28 pins), mechanical_marking (5 pins)
+3.3V_3.3V_EN: power_regulator_pmic (R201.2), power_regulator_aux (R71.2 TP6.1 U7.2)
AUDIO_I2C_SCL: imx6_ctrl_i2c1 (R24.2), audio_codec (U11.19)
AUDIO_I2C_SDA: imx6_ctrl_i2c1 (R23.2), audio_codec (U11.18)
CdE_I2C_SCL: gpio (R109.2), extension_card (J10.56A U1.U5)
CdE_I2C_SDA: gpio (R108.1), extension_card (J10.54A U1.T7)
EEPROM_I2C_SCL: imx6_ctrl_i2c1 (R20.2), sd_flash_eeprom (U10.6)
EEPROM_I2C_SDA: imx6_ctrl_i2c1 (R19.2), sd_flash_eeprom (U10.5)
HDMI_I2C_SCL: imx6_ctrl_i2c1 (R26.2), hdmi (Q4.S)
HDMI_I2C_SDA: imx6_ctrl_i2c1 (R25.2), hdmi (Q5.S)
NetC11_1: imx6_ctrl_i2c1 (6 pins), extension_card (R178.2)
ONOFF: imx6_ctrl_i2c1 (C7.1 PB1.2 U1.D12), extension_card (R177.2)
PCIe_SMB_CLK: imx6_ctrl_i2c1 (R18.2), mini_pcie (J8.30)
PCIe_SMB_DATA: imx6_ctrl_i2c1 (R17.2), mini_pcie (J8.32)
SATA_I2C_SCL: imx6_ctrl_i2c1 (R22.2), sata_m2 (J10.56)
SATA_I2C_SDA: imx6_ctrl_i2c1 (R21.2), sata_m2 (J10.58)
USB_CdE_N: usb_host_otg (U13.8), extension_card (L7.3)
USB_CdE_P: usb_host_otg (U13.7), extension_card (L7.2)
USB_DEBUG_N: power_regulator_aux (L2.3), uart_console (U12.4)
USB_DEBUG_P: power_regulator_aux (L2.2), uart_console (U12.3)
USB_PCIe_N: mini_pcie (L3.2), usb_host_otg (U13.13)
USB_PCIe_P: mini_pcie (L3.3), usb_host_otg (U13.12)